# EAGLE design Power-Conversion (EAGLE 7.7.0)
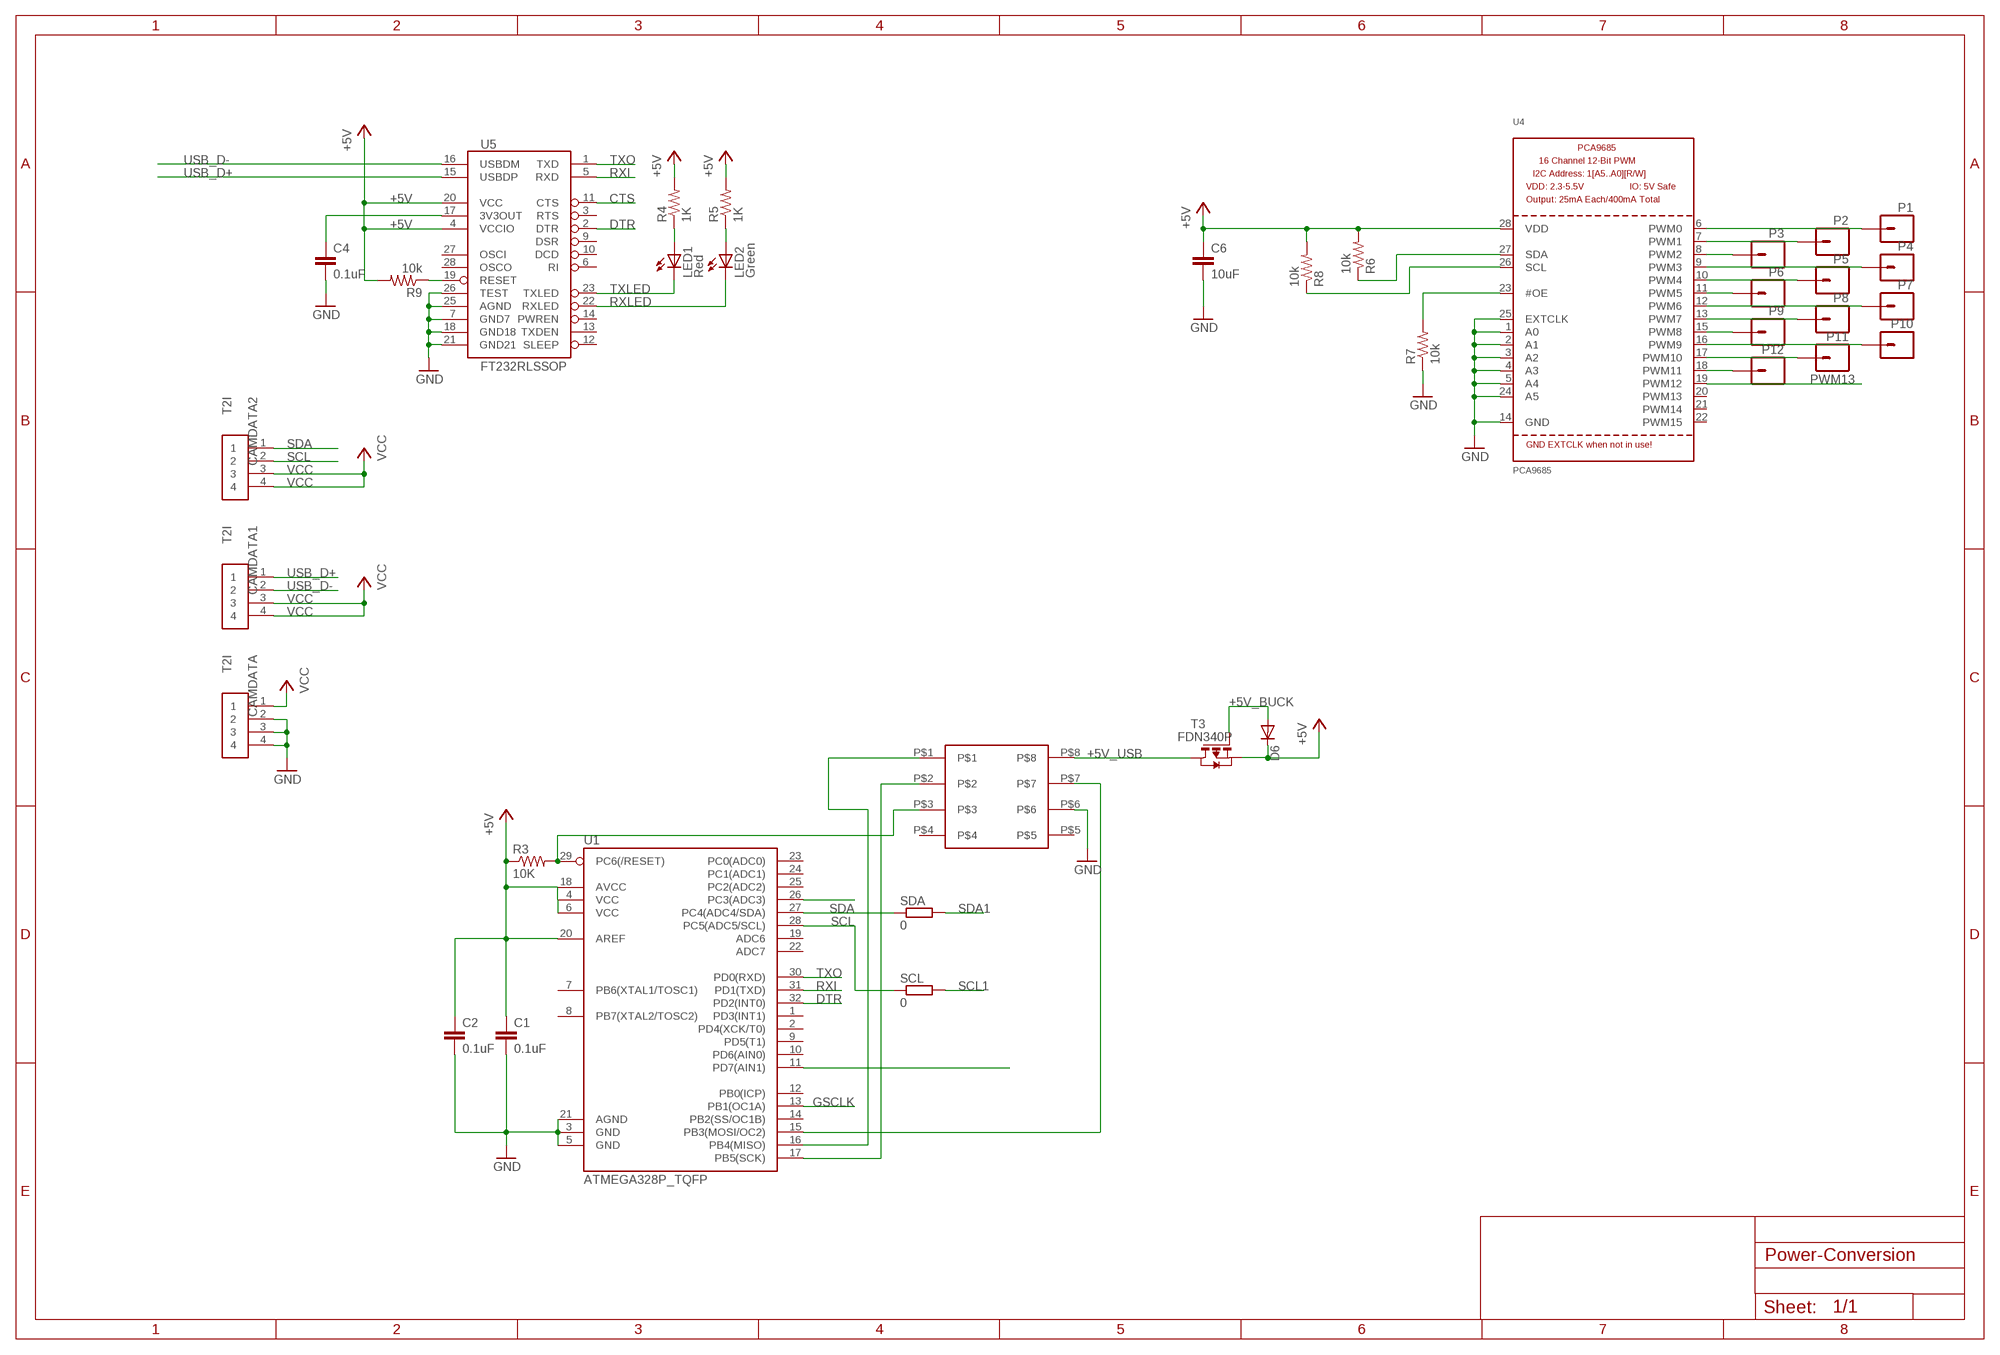
[diagram p0: schematic, sheet 1, part 1 of 2]
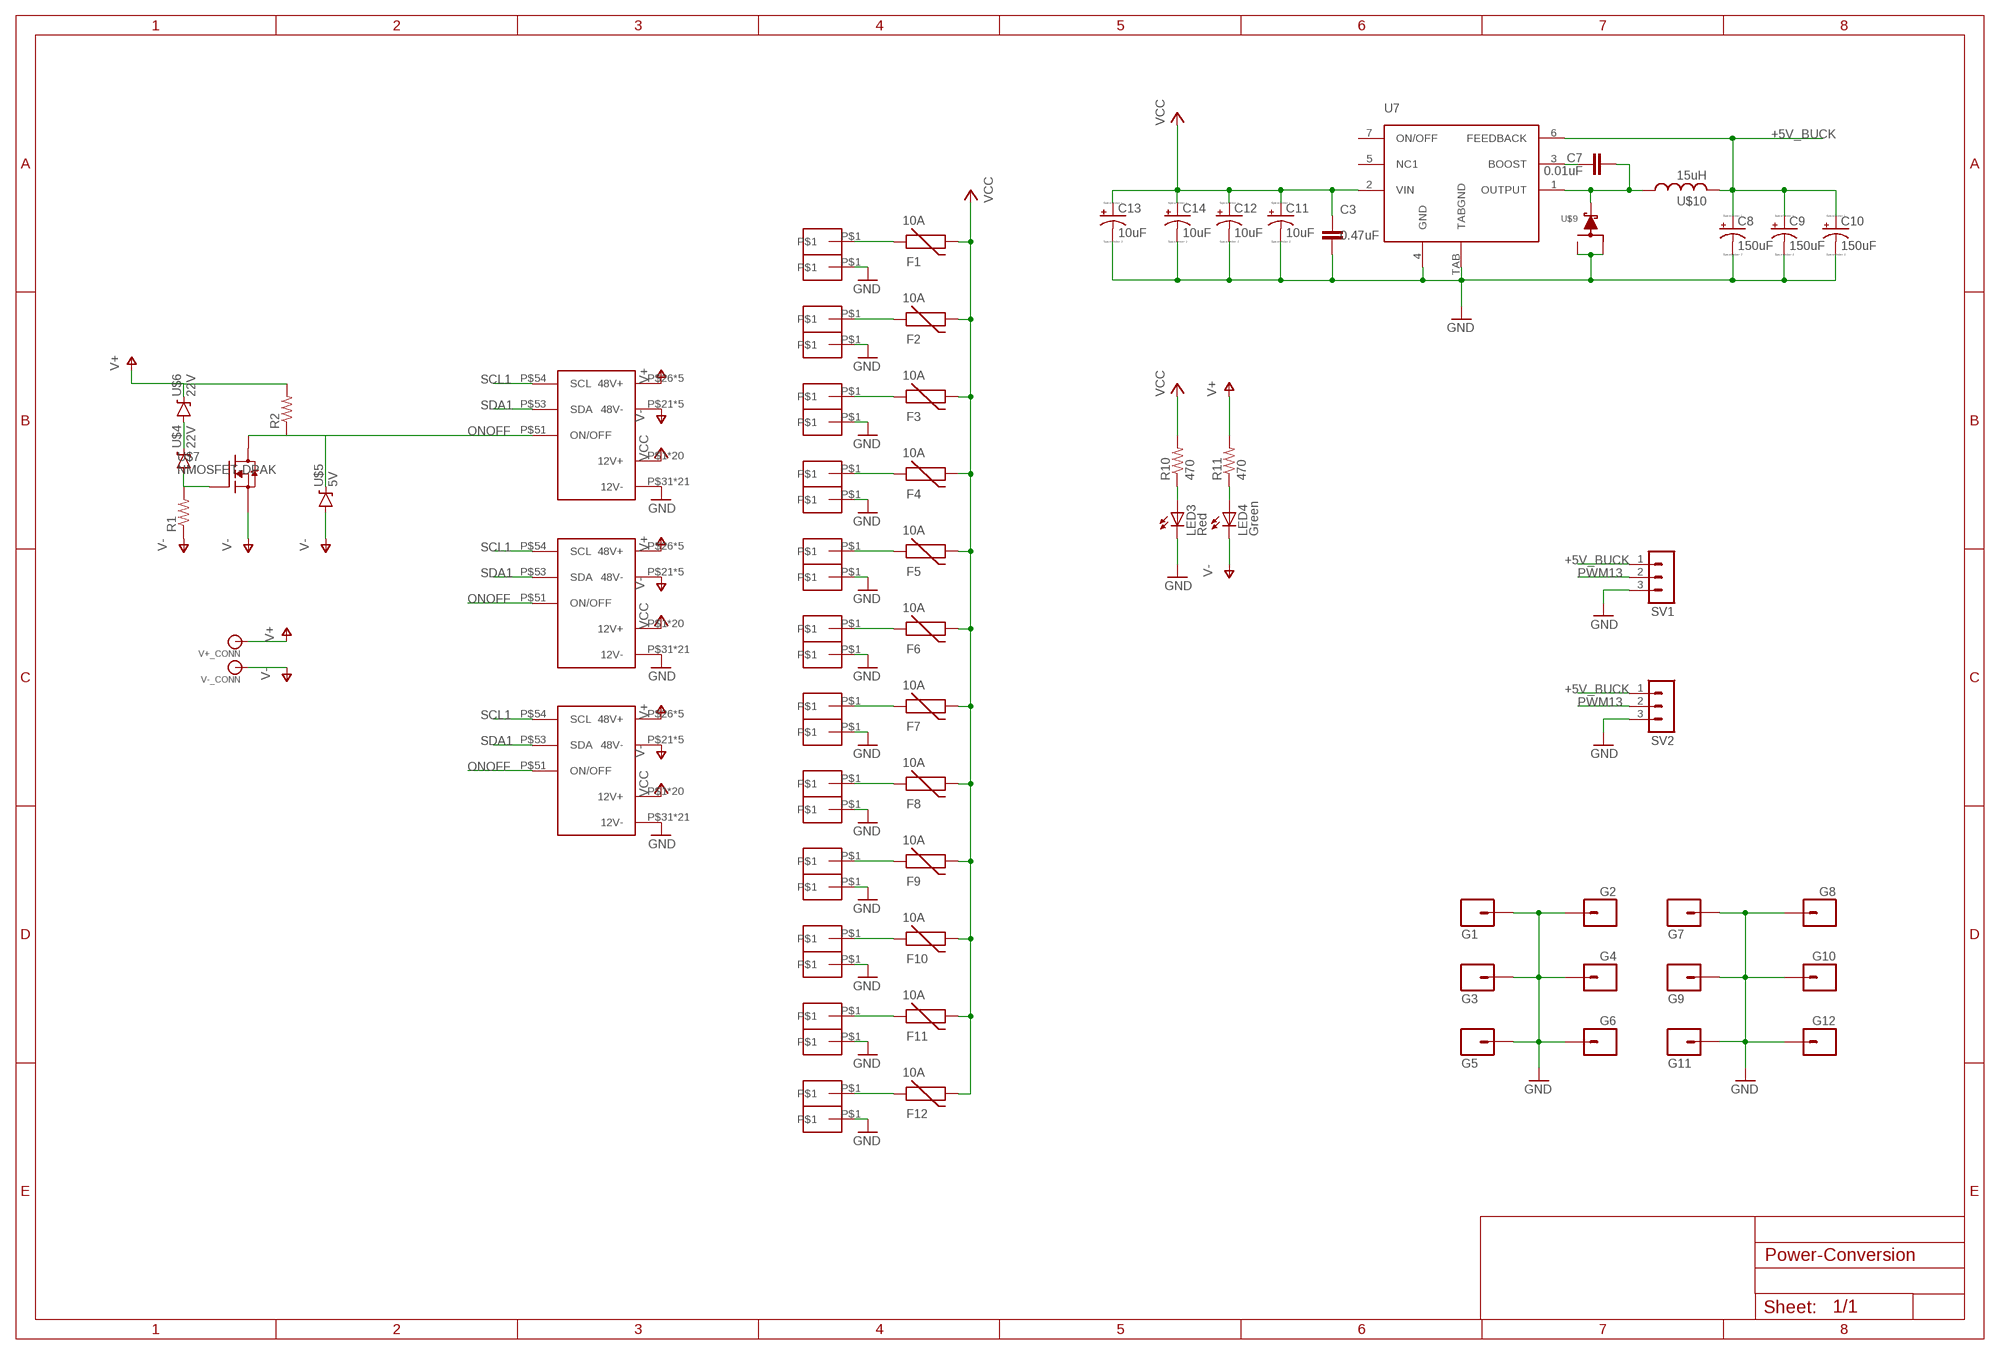
[diagram p1: schematic, sheet 1, part 2 of 2]

## Parts
C1  0.1uF  0.1UF-25V(+80/-20%)(0603)  [0603-CAP]
C2  0.1uF  0.1UF-25V(+80/-20%)(0603)  [0603-CAP]
C3  0.47uF  C-EUC0603  [C0603]
C4  0.1uF  0.1UF-25V(+80/-20%)(0603)  [0603-CAP]
C6  10uF  0.1UF-25V(+80/-20%)(0603)  [0603-CAP]
C7  0.01uF  CAP0603-CAP  [0603-CAP]
C8  150uF  C-TANTALUM(10UF_150UF)  [CTAN(7.30_4.30MM)]
C9  150uF  C-TANTALUM(10UF_150UF)  [CTAN(7.30_4.30MM)]
C10  150uF  C-TANTALUM(10UF_150UF)  [CTAN(7.30_4.30MM)]
C11  10uF  C-TANTALUM(10UF_150UF)  [CTAN(7.30_4.30MM)]
C12  10uF  C-TANTALUM(10UF_150UF)  [CTAN(7.30_4.30MM)]
C13  10uF  C-TANTALUM(10UF_150UF)  [CTAN(7.30_4.30MM)]
C14  10uF  C-TANTALUM(10UF_150UF)  [CTAN(7.30_4.30MM)]
CAMDATA  T2I  [T2I]
CAMDATA1  T2I  [T2I]
CAMDATA2  T2I  [T2I]
D6  DIODE-DO-214AC  [DO-214AC]
F1  10A  PTC(2920L)  [PTC-2920]
F2  10A  PTC(2920L)  [PTC-2920]
F3  10A  PTC(2920L)  [PTC-2920]
F4  10A  PTC(2920L)  [PTC-2920]
F5  10A  PTC(2920L)  [PTC-2920]
F6  10A  PTC(2920L)  [PTC-2920]
F7  10A  PTC(2920L)  [PTC-2920]
F8  10A  PTC(2920L)  [PTC-2920]
F9  10A  PTC(2920L)  [PTC-2920]
F10  10A  PTC(2920L)  [PTC-2920]
F11  10A  PTC(2920L)  [PTC-2920]
F12  10A  PTC(2920L)  [PTC-2920]
G1  M01PTH  [1X01]
G2  M01PTH  [1X01]
G3  M01PTH  [1X01]
G4  M01PTH  [1X01]
G5  M01PTH  [1X01]
G6  M01PTH  [1X01]
G7  M01PTH  [1X01]
G8  M01PTH  [1X01]
G9  M01PTH  [1X01]
G10  M01PTH  [1X01]
G11  M01PTH  [1X01]
G12  M01PTH  [1X01]
LED1  Red  LED0603  [LED-0603]
LED2  Green  LED0603  [LED-0603]
LED3  Red  LED0603  [LED-0603]
LED4  Green  LED0603  [LED-0603]
P1  M01PTH  [1X01]
P2  M01PTH  [1X01]
P3  M01PTH  [1X01]
P4  M01PTH  [1X01]
P5  M01PTH  [1X01]
P6  M01PTH  [1X01]
P7  M01PTH  [1X01]
P8  M01PTH  [1X01]
P9  M01PTH  [1X01]
P10  M01PTH  [1X01]
P11  M01PTH  [1X01]
P12  M01PTH  [1X01]
R1  RESISTOR0603-RES  [0603-RES]
R2  RESISTOR0603-RES  [0603-RES]
R3  10K  10KOHM-1/10W-1%(0603)0603  [0603-RES]
R4  1K  R-US_R0603  [R0603]
R5  1K  R-US_R0603  [R0603]
R6  10k  470OHM1/10W1%(0603)  [0603-RES]
R7  10k  470OHM1/10W1%(0603)  [0603-RES]
R8  10k  470OHM1/10W1%(0603)  [0603-RES]
R9  10k  RESISTOR0402-RES  [0402-RES]
R10  470  R-US_R0603  [R0603]
R11  470  R-US_R0603  [R0603]
SCL  0  R-EU_R0603  [R0603]
SDA  0  R-EU_R0603  [R0603]
SV1  MA03-1  [MA03-1]
SV2  MA03-1  [MA03-1]
T3  FDN340P  [SOT-23]
U1  ATMEGA328P_TQFP  [TQFP32-08]
U4  PCA9685  [TSSOP28]
U5  FT232RLSSOP  [SSOP28DB]
U7  LM2678  [LM2678]
U$1  POWER-BRICK-CONNECTOR  [POWER-BRICK-CONNECTOR]
U$2  POWER-BRICK-CONNECTOR  [POWER-BRICK-CONNECTOR]
U$3  POWER-BRICK-CONNECTOR  [POWER-BRICK-CONNECTOR]
U$4  22V  ZENER-SOT23  [SOT23-3]
U$5  5V  ZENER-SOT23  [SOT23-3]
U$6  22V  ZENER-SOT23  [SOT23-3]
U$7  NMOSFET-DPAK  [DPAK]
U$8  8_PIN_HEADER  [8_PIN_HEADER]
U$9  SWITCHMODE_SCHOTTKY  [DPAK-3]
U$10  15uH  HCMA1305  [HCMA1305]
V+_CONN  BANANA_CONN  [BANANA_CONN]
V+_ESC1  16_GUAGE_WIRE  [16_GUAGE_WIRE]
V+_ESC2  16_GUAGE_WIRE  [16_GUAGE_WIRE]
V+_ESC3  16_GUAGE_WIRE  [16_GUAGE_WIRE]
V+_ESC4  16_GUAGE_WIRE  [16_GUAGE_WIRE]
V+_ESC5  16_GUAGE_WIRE  [16_GUAGE_WIRE]
V+_ESC6  16_GUAGE_WIRE  [16_GUAGE_WIRE]
V+_ESC7  16_GUAGE_WIRE  [16_GUAGE_WIRE]
V+_ESC8  16_GUAGE_WIRE  [16_GUAGE_WIRE]
V+_ESC9  16_GUAGE_WIRE  [16_GUAGE_WIRE]
V+_ESC10  16_GUAGE_WIRE  [16_GUAGE_WIRE]
V+_ESC11  16_GUAGE_WIRE  [16_GUAGE_WIRE]
V+_ESC12  16_GUAGE_WIRE  [16_GUAGE_WIRE]
V-_CONN  BANANA_CONN  [BANANA_CONN]
V-_ESC1  16_GUAGE_WIRE  [16_GUAGE_WIRE]
V-_ESC2  16_GUAGE_WIRE  [16_GUAGE_WIRE]
V-_ESC3  16_GUAGE_WIRE  [16_GUAGE_WIRE]
V-_ESC4  16_GUAGE_WIRE  [16_GUAGE_WIRE]
V-_ESC5  16_GUAGE_WIRE  [16_GUAGE_WIRE]
V-_ESC6  16_GUAGE_WIRE  [16_GUAGE_WIRE]
V-_ESC7  16_GUAGE_WIRE  [16_GUAGE_WIRE]
V-_ESC8  16_GUAGE_WIRE  [16_GUAGE_WIRE]
V-_ESC9  16_GUAGE_WIRE  [16_GUAGE_WIRE]
V-_ESC10  16_GUAGE_WIRE  [16_GUAGE_WIRE]
V-_ESC11  16_GUAGE_WIRE  [16_GUAGE_WIRE]
V-_ESC12  16_GUAGE_WIRE  [16_GUAGE_WIRE]

## Nets
+5V: C1.1 C2.1 C6.1 D6.C R3.1 R4.2 R5.2 R6.2 R8.2 R9.2 T3.2(S) U1.4(VCC) U1.6(VCC) U1.18(AVCC) U1.20(AREF) U4.28(VDD) U5.4(VCCIO) U5.20(VCC)
+5V_BUCK: C8.+ C9.+ C10.+ D6.A SV1.1 SV2.1 T3.3(G) U7.6(FEEDBACK) U$10.P$2
+5V_USB: T3.1(D) U$8.P$8
CTS: U1.26(PC3(ADC3)) U5.11(CTS)
DTR: U1.32(PD2(INT0)) U5.2(DTR)
GND: C1.2 C2.2 C3.2 C4.2 C6.2 C8.- C9.- C10.- C11.- C12.- C13.- C14.- CAMDATA.2 CAMDATA.3 CAMDATA.4 G1.1 G2.1 G3.1 G4.1 G5.1 G6.1 G7.1 G8.1 G9.1 G10.1 G11.1 G12.1 LED3.C R7.1 SV1.3 SV2.3 U1.3(GND) U1.5(GND) U1.21(AGND) U4.1(A0) U4.2(A1) U4.3(A2) U4.4(A3) U4.5(A4) U4.14(GND) U4.24(A5) U4.25(EXTCLK) U5.7(GND7) U5.18(GND18) U5.21(GND21) U5.25(AGND) U5.26(TEST) U7.4(GND) U7.TAB(TABGND) U$1.P$31(12V-) U$1.P$32(12V-) U$1.P$33(12V-) U$1.P$34(12V-) U$1.P$35(12V-) U$1.P$36(12V-) U$1.P$37(12V-) U$1.P$38(12V-) U$1.P$39(12V-) U$1.P$40(12V-) U$1.P$41(12V-) U$1.P$42(12V-) U$1.P$43(12V-) U$1.P$44(12V-) U$1.P$45(12V-) U$1.P$46(12V-) U$1.P$47(12V-) U$1.P$48(12V-) U$1.P$49(12V-) U$1.P$50(12V-) U$1.P$52(12V-) U$2.P$31(12V-) U$2.P$32(12V-) U$2.P$33(12V-) U$2.P$34(12V-) U$2.P$35(12V-) U$2.P$36(12V-) U$2.P$37(12V-) U$2.P$38(12V-) U$2.P$39(12V-) U$2.P$40(12V-) U$2.P$41(12V-) U$2.P$42(12V-) U$2.P$43(12V-) U$2.P$44(12V-) U$2.P$45(12V-) U$2.P$46(12V-) U$2.P$47(12V-) U$2.P$48(12V-) U$2.P$49(12V-) U$2.P$50(12V-) U$2.P$52(12V-) U$3.P$31(12V-) U$3.P$32(12V-) U$3.P$33(12V-) U$3.P$34(12V-) U$3.P$35(12V-) U$3.P$36(12V-) U$3.P$37(12V-) U$3.P$38(12V-) U$3.P$39(12V-) U$3.P$40(12V-) U$3.P$41(12V-) U$3.P$42(12V-) U$3.P$43(12V-) U$3.P$44(12V-) U$3.P$45(12V-) U$3.P$46(12V-) U$3.P$47(12V-) U$3.P$48(12V-) U$3.P$49(12V-) U$3.P$50(12V-) U$3.P$52(12V-) U$8.P$6 U$9.P$1 U$9.P$3 V-_ESC1.P$1 V-_ESC2.P$1 V-_ESC3.P$1 V-_ESC4.P$1 V-_ESC5.P$1 V-_ESC6.P$1 V-_ESC7.P$1 V-_ESC8.P$1 V-_ESC9.P$1 V-_ESC10.P$1 V-_ESC11.P$1 V-_ESC12.P$1
GSCLK: U1.13(PB1(OC1A))
N$1: F1.1 V+_ESC1.P$1
N$2: P11.1 U4.17(PWM10)
N$3: F2.1 V+_ESC2.P$1
N$4: P12.1 U4.18(PWM11)
N$5: F3.1 V+_ESC3.P$1
N$6: F5.1 V+_ESC5.P$1
N$7: F6.1 V+_ESC6.P$1
N$8: F7.1 V+_ESC7.P$1
N$9: U$4.3(C) U$6.1(A)
N$10: R1.2 U$4.1(A) U$7.1(G)
N$11: F8.1 V+_ESC8.P$1
N$12: LED1.A R4.1
N$13: R3.2 U1.29(PC6(/RESET)) U$8.P$3
N$14: LED2.A R5.1
N$15: P1.1 U4.6(PWM0)
N$16: P2.1 U4.7(PWM1)
N$17: P3.1 U4.8(PWM2)
N$18: P4.1 U4.9(PWM3)
N$19: P5.1 U4.10(PWM4)
N$20: P6.1 U4.11(PWM5)
N$21: P7.1 U4.12(PWM6)
N$22: P8.1 U4.13(PWM7)
N$23: P9.1 U4.15(PWM8)
N$24: P10.1 U4.16(PWM9)
N$25: C7.1 U7.3(BOOST)
N$26: U1.15(PB3(MOSI/OC2)) U$8.P$7
N$27: U1.11(PD7(AIN1))
N$28: F9.1 V+_ESC9.P$1
N$29: U1.16(PB4(MISO)) U$8.P$1
N$30: F10.1 V+_ESC10.P$1
N$31: U1.17(PB5(SCK)) U$8.P$2
N$32: F4.1 V+_ESC4.P$1
N$33: F11.1 V+_ESC11.P$1
N$34: F12.1 V+_ESC12.P$1
N$35: R7.2 U4.23(#OE)
N$36: C7.2 U7.1(OUTPUT) U$9.P$4 U$10.P$1
N$37: C4.1 U5.17(3V3OUT)
N$38: R9.1 U5.19(RESET)
N$39: LED3.A R10.1
N$40: LED4.A R11.1
ONOFF: R2.1 U$1.P$51(ON/OFF) U$2.P$51(ON/OFF) U$3.P$51(ON/OFF) U$5.3(C) U$7.4(D1)
PWM13: SV1.2 SV2.2 U4.19(PWM12)
RXI: U1.31(PD1(TXD)) U5.5(RXD)
RXLED: LED2.C U5.22(RXLED)
SCL: CAMDATA2.2 R8.1 SCL.1 U1.28(PC5(ADC5/SCL)) U4.26(SCL)
SCL1: SCL.2 U$1.P$54(SCL) U$2.P$54(SCL) U$3.P$54(SCL)
SDA: CAMDATA2.1 R6.1 SDA.1 U1.27(PC4(ADC4/SDA)) U4.27(SDA)
SDA1: SDA.2 U$1.P$53(SDA) U$2.P$53(SDA) U$3.P$53(SDA)
TXLED: LED1.C U5.23(TXLED)
TXO: U1.30(PD0(RXD)) U5.1(TXD)
USB_D+: CAMDATA1.1 U5.15(USBDP)
USB_D-: CAMDATA1.2 U5.16(USBDM)
V+: R2.2 R11.2 U$1.P$26(48V+) U$1.P$27(48V+) U$1.P$28(48V+) U$1.P$29(48V+) U$1.P$30(48V+) U$2.P$26(48V+) U$2.P$27(48V+) U$2.P$28(48V+) U$2.P$29(48V+) U$2.P$30(48V+) U$3.P$26(48V+) U$3.P$27(48V+) U$3.P$28(48V+) U$3.P$29(48V+) U$3.P$30(48V+) U$6.3(C) V+_CONN.P$1
V-: LED4.C R1.1 U$1.P$21(48V-) U$1.P$22(48V-) U$1.P$23(48V-) U$1.P$24(48V-) U$1.P$25(48V-) U$2.P$21(48V-) U$2.P$22(48V-) U$2.P$23(48V-) U$2.P$24(48V-) U$2.P$25(48V-) U$3.P$21(48V-) U$3.P$22(48V-) U$3.P$23(48V-) U$3.P$24(48V-) U$3.P$25(48V-) U$5.1(A) U$7.3(S) V-_CONN.P$1
VCC: C3.1 C11.+ C12.+ C13.+ C14.+ CAMDATA1.3 CAMDATA1.4 CAMDATA2.3 CAMDATA2.4 CAMDATA.1 F1.2 F2.2 F3.2 F4.2 F5.2 F6.2 F7.2 F8.2 F9.2 F10.2 F11.2 F12.2 R10.2 U7.2(VIN) U$1.P$1(12V+) U$1.P$2(12V+) U$1.P$3(12V+) U$1.P$4(12V+) U$1.P$5(12V+) U$1.P$6(12V+) U$1.P$7(12V+) U$1.P$8(12V+) U$1.P$9(12V+) U$1.P$10(12V+) U$1.P$11(12V+) U$1.P$12(12V+) U$1.P$13(12V+) U$1.P$14(12V+) U$1.P$15(12V+) U$1.P$16(12V+) U$1.P$17(12V+) U$1.P$18(12V+) U$1.P$19(12V+) U$1.P$20(12V+) U$2.P$1(12V+) U$2.P$2(12V+) U$2.P$3(12V+) U$2.P$4(12V+) U$2.P$5(12V+) U$2.P$6(12V+) U$2.P$7(12V+) U$2.P$8(12V+) U$2.P$9(12V+) U$2.P$10(12V+) U$2.P$11(12V+) U$2.P$12(12V+) U$2.P$13(12V+) U$2.P$14(12V+) U$2.P$15(12V+) U$2.P$16(12V+) U$2.P$17(12V+) U$2.P$18(12V+) U$2.P$19(12V+) U$2.P$20(12V+) U$3.P$1(12V+) U$3.P$2(12V+) U$3.P$3(12V+) U$3.P$4(12V+) U$3.P$5(12V+) U$3.P$6(12V+) U$3.P$7(12V+) U$3.P$8(12V+) U$3.P$9(12V+) U$3.P$10(12V+) U$3.P$11(12V+) U$3.P$12(12V+) U$3.P$13(12V+) U$3.P$14(12V+) U$3.P$15(12V+) U$3.P$16(12V+) U$3.P$17(12V+) U$3.P$18(12V+) U$3.P$19(12V+) U$3.P$20(12V+)
Unconnected: U1.1(PD3(INT1)) U1.2(PD4(XCK/T0)) U1.7(PB6(XTAL1/TOSC1)) U1.8(PB7(XTAL2/TOSC2)) U1.9(PD5(T1)) U1.10(PD6(AIN0)) U1.12(PB0(ICP)) U1.14(PB2(SS/OC1B)) U1.19(ADC6) U1.22(ADC7) U1.23(PC0(ADC0)) U1.24(PC1(ADC1)) U1.25(PC2(ADC2)) U4.20(PWM13) U4.21(PWM14) U4.22(PWM15) U5.3(RTS) U5.6(RI) U5.9(DSR) U5.10(DCD) U5.12(SLEEP) U5.13(TXDEN) U5.14(PWREN) U5.27(OSCI) U5.28(OSCO) U7.5(NC1) U7.7(ON/OFF) U$8.P$4 U$8.P$5

## Library data of the parts
C1 C2 C4 = SparkFun-Capacitors:0.1UF-25V(+80/-20%)(0603): CAP-00810 Ceramic Standard decoupling cap; PROD_ID: CAP-00810
C3 = rcl:C-EU: CAPACITOR, European symbol
C6 = SparkFun-Capacitors:0.1UF-25V(+80/-20%)(0603): CAP-00810 Ceramic Standard decoupling cap; PROD_ID: CAP-00810; VALUE: 0.1uF
C7 = SparkFun-Passives:CAP: Capacitor Standard 0603 ceramic capacitor, and 0.1" leaded capacitor.
C8-C14 = PowerComponents:C-TANTALUM(10UF_150UF)
CAMDATA CAMDATA1 CAMDATA2 = BACKPLANE:T2I
D6 = DiscreteComponents:DIODE-: DIODE
F1-F12 = PowerComponents:PTC(2920L)
G1-G12 P1-P12 = SparkFun-Connectors:M01: Header 1 Standard 1-pin 0.1" header. Use with straight break away headers (SKU : PRT-00116), right angle break away headers (PRT-00553), swiss pins (PRT-00743), machine pins (PRT-00117), and female headers (PRT-00115). SMTSO-256-ET is a "flush mount" nut for a 4-40 screw. The older package used to be too tight, and did not allow it to sit properly thru the drill hit. The latest (0.165DIA) fits nice and snug.
LED1-LED4 = SparkFun:LED: LEDs Standard schematic elements and footprints for 5mm, 3mm, 1206, and 0603 sized LEDs. 5mm - Spark Fun Electronics SKU : COM-00529 (and others)
R1 R2 = SparkFun-Passives:RESISTOR: Resistor Basic schematic elements and footprints for 0603, 1206, and PTH resistors.
R3 = SparkFun-Resistors:10KOHM-1/10W-1%(0603): RES-00824; PROD_ID: RES-00824
R4 R5 R10 R11 = resistor:R-US_: RESISTOR, American symbol
R6-R8 = SparkFun-Resistors:470OHM1/10W1%(0603): RES-07869; PROD_ID: RES-07869; VALUE: 470
R9 = SparkFun:RESISTOR: Resistor Basic schematic elements and footprints for 0603, 1206, and PTH resistors.
SCL SDA = rcl:R-EU_: RESISTOR, European symbol
SV1 SV2 = con-lstb:MA03-1: PIN HEADER; OC_FARNELL: unknown; OC_NEWARK: unknown
T3 = DiscreteComponents:FDN340P: MOS FET; DIGIKEY: FDN340PCT-ND
U1 = SparkFun-DigitalIC:ATMEGA328P_TQFP; PROD_ID: IC-09069
U4 = microbuilder:PCA9685: PCA9685 - 16 Channel 12-Bit I2C PWM Controller 5.0V tolerant 16 channel, 12-bit I2C PWM controller with 25mA per output (max. 400mA total) Digikey: 568-5931-1-ND
U5 = SparkFun:FT232RL: USB UART FT232RL 4th Generation USB UART (USB <-> Serial) Controller. Spark Fun Electronics SKU : COM-00650
U7 = PowerComponents:LM2678: LM2678 Buck Converter IC 12V-to-5V
U$1-U$3 = MotherboardParts:POWER-BRICK-CONNECTOR
U$4 U$6 = MotherboardParts:ZENER-SOT23; PN-DIGI: BZX84C22LT1GOSCT-ND
U$5 = MotherboardParts:ZENER-SOT23
U$7 = MotherboardParts:NMOSFET-DPAK; PN-DIGI: 497-4329-1-ND; VDSS: 60V
U$8 = PowerComponents:8_PIN_HEADER
U$9 = PowerComponents:SWITCHMODE_SCHOTTKY: {Digi-Key Part Number: MBRD835LT4GOSCT-ND} {Voltage - DC Reverse (Vr) (Max): 35V} {Current - Average Rectified (Io): 8A} {Voltage - Forward (Vf) (Max) @ If: 510mV @ 8A} {Speed: Fast Recovery =< 500ns, > 200mA (Io)} {Current - Reverse Leakage @ Vr: 1.4mA @ 35V} {Mounting Type: Surface Mount} {Package / Case: TO-252-3, DPak (2 Leads + Tab), SC-63} {Supplier Device Package: DPAK-3} {Operating Temperature - Junction: -65°C ~ 150°C}
U$10 = DiscreteComponents:HCMA1305
V+_CONN V-_CONN = SparkFun-Connectors:BANANA_CONN: Through-hole banana jack
V+_ESC1-V+_ESC12 V-_ESC1-V-_ESC12 = PowerComponents:16_GUAGE_WIRE

## Net classes
1 power: width 0.254 mm

## Board
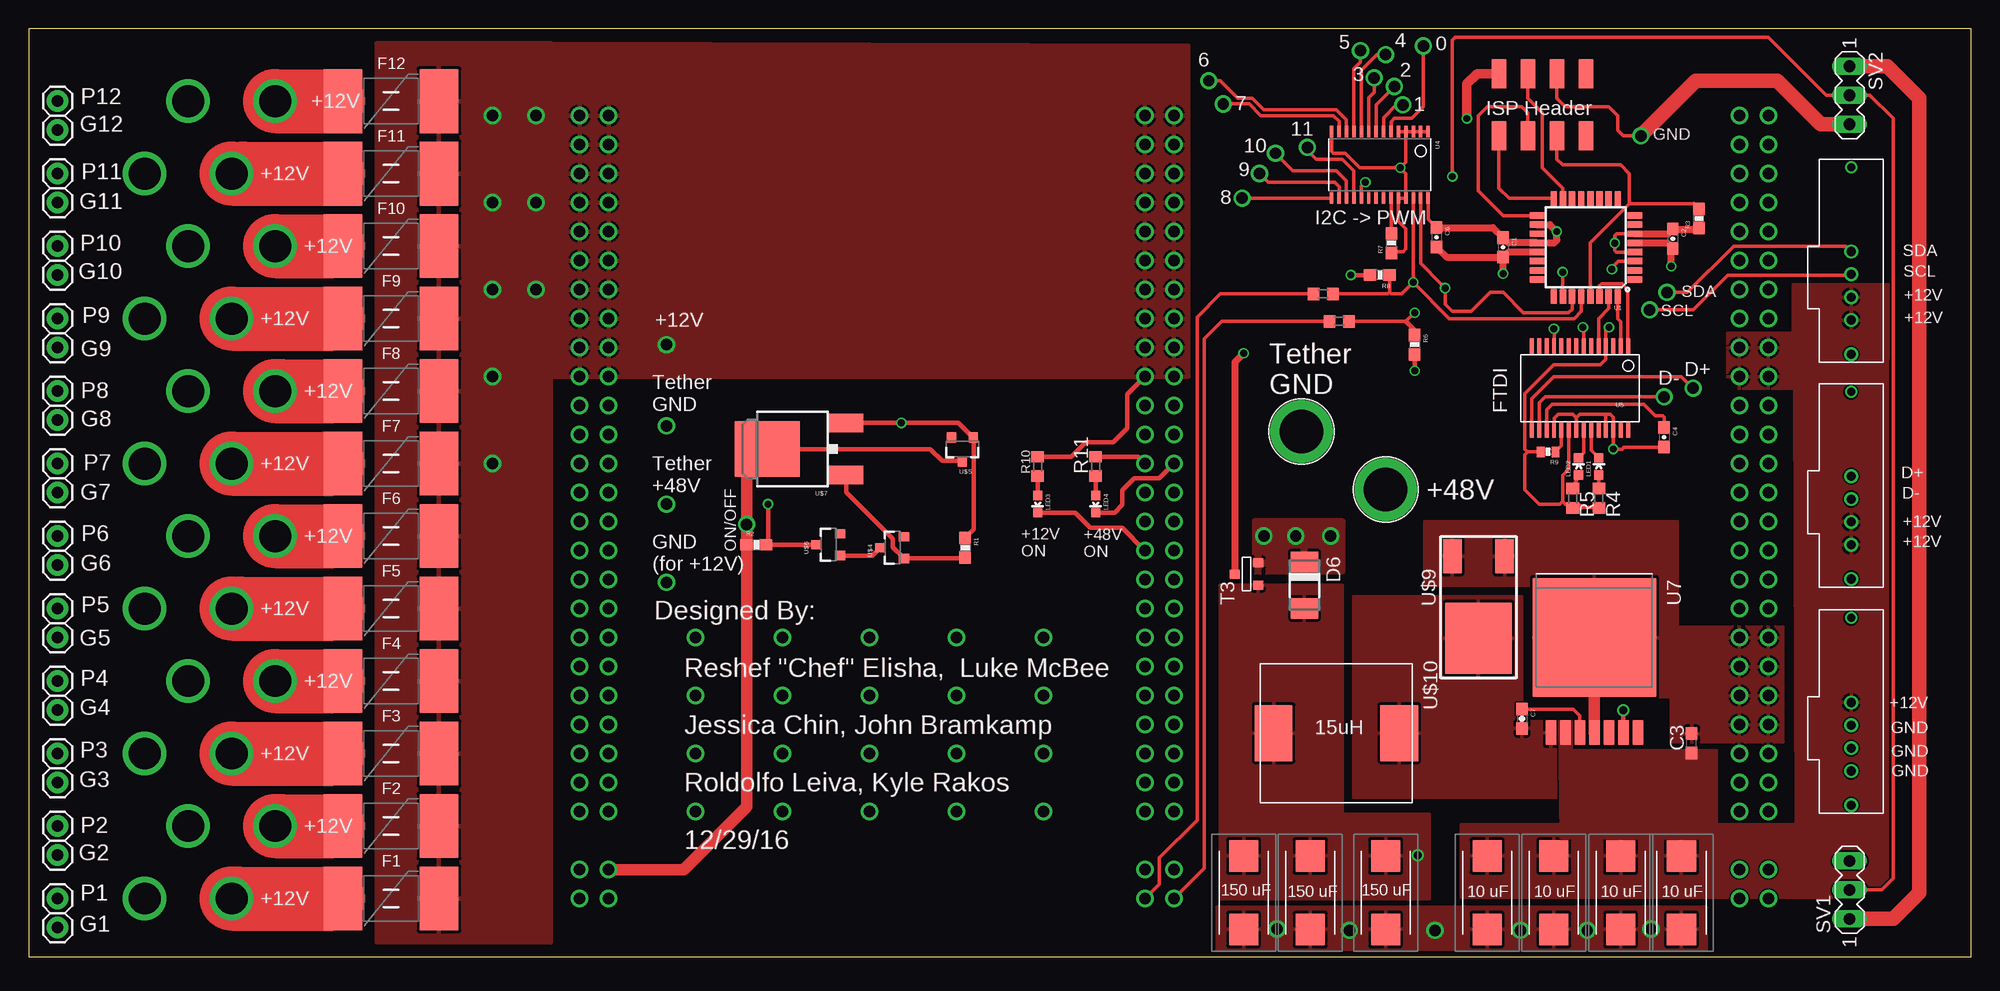
[diagram p2: board, top side]
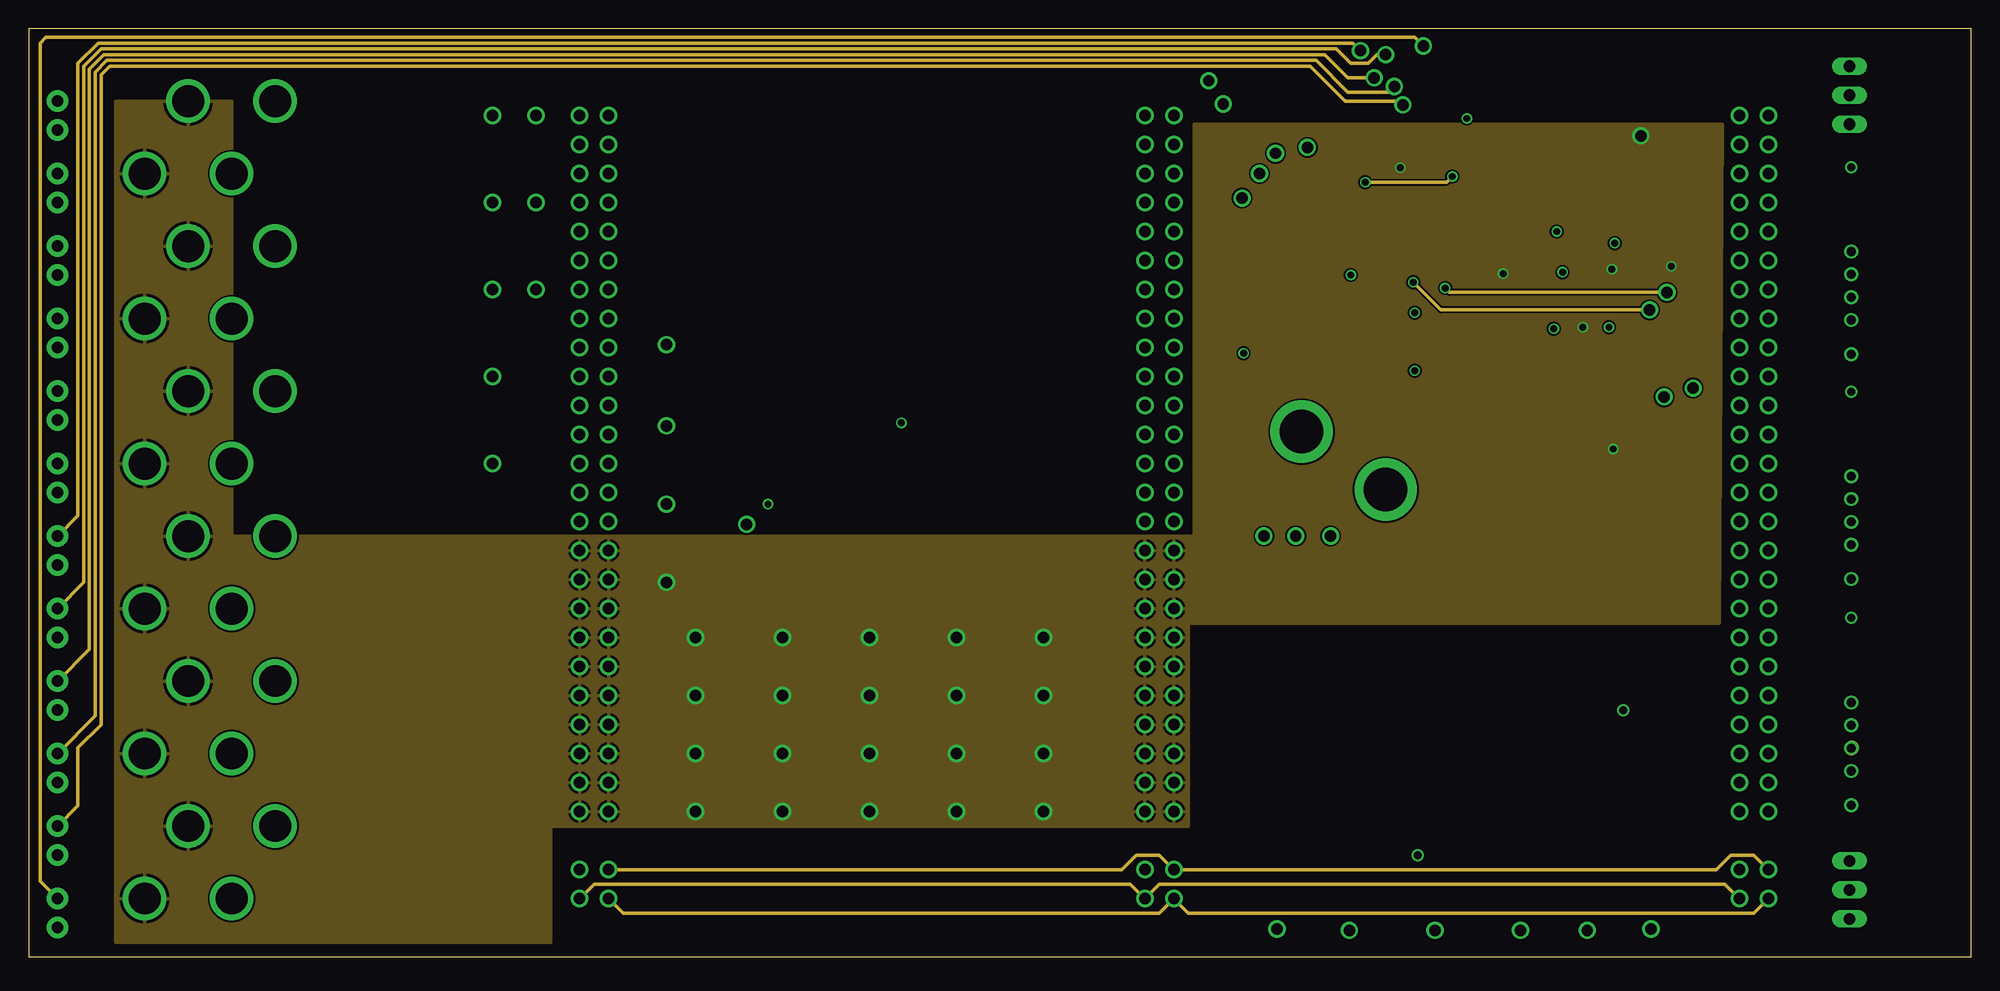
[diagram p3: board, inner layer Route2]
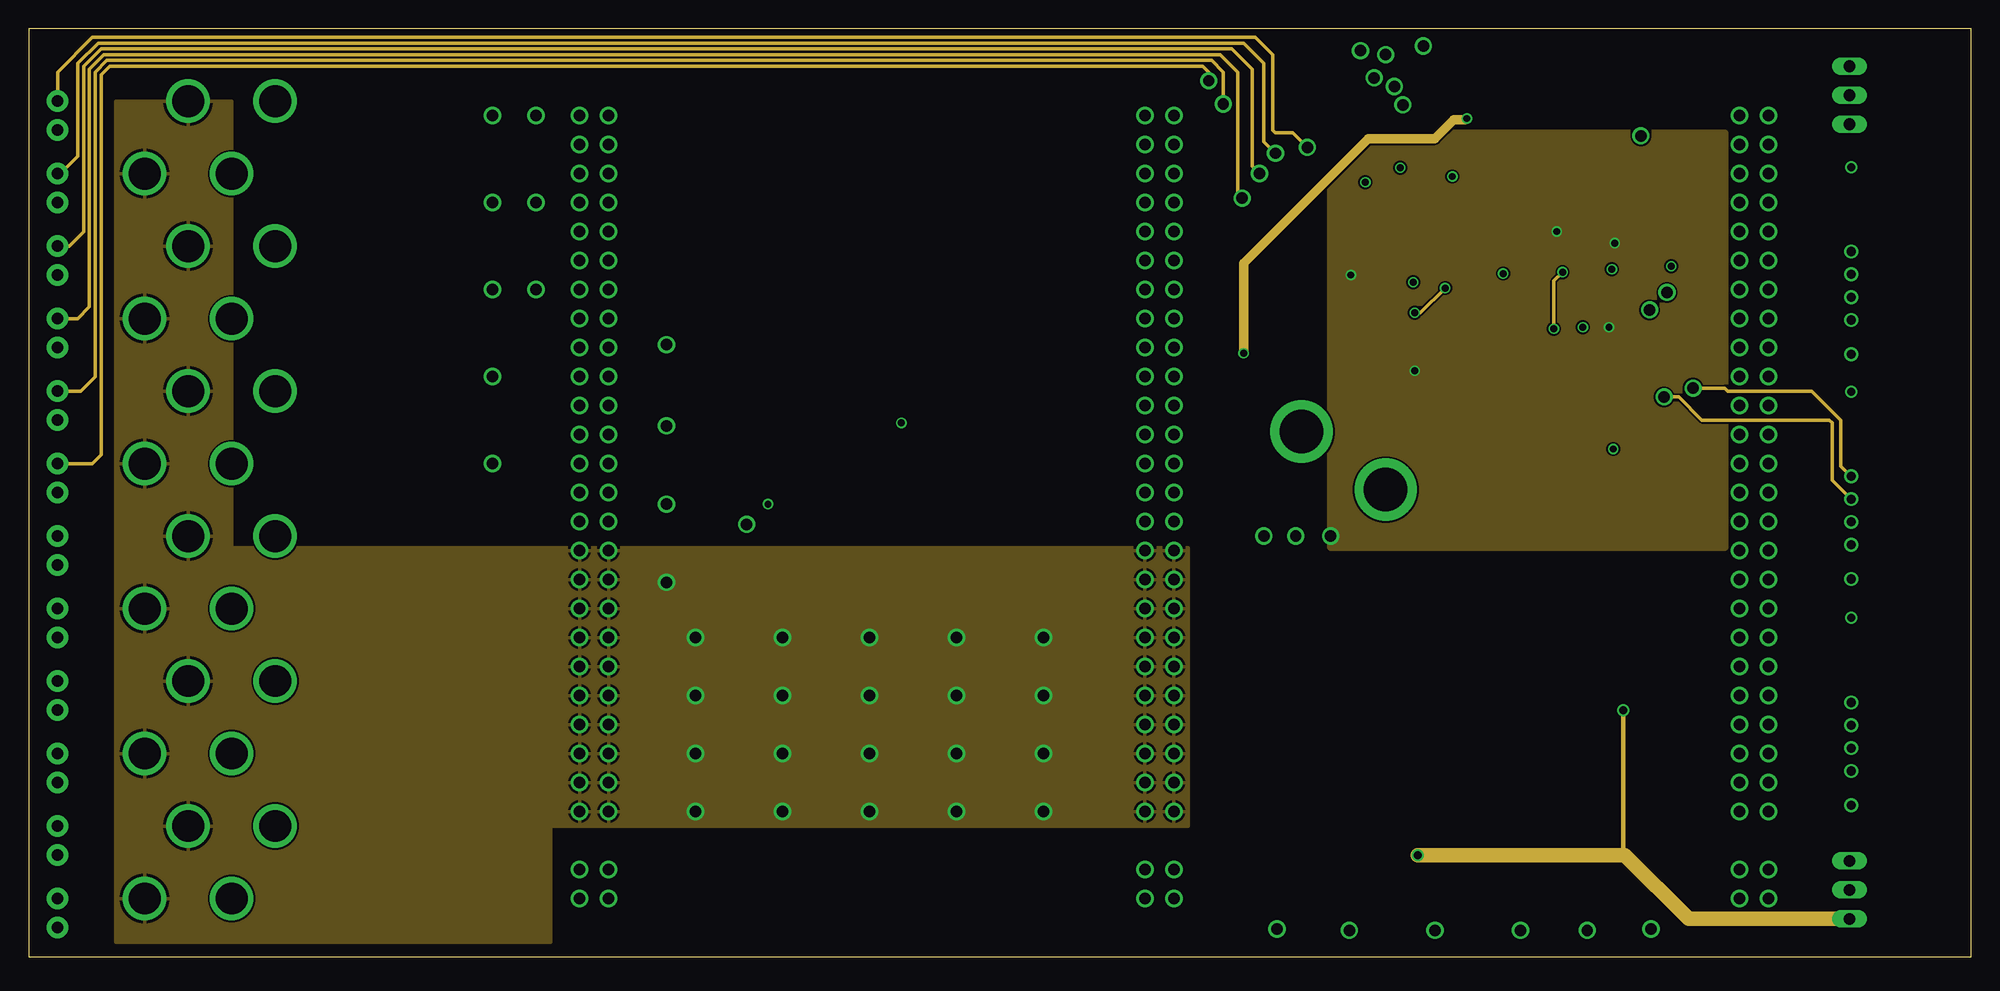
[diagram p4: board, inner layer Route15]
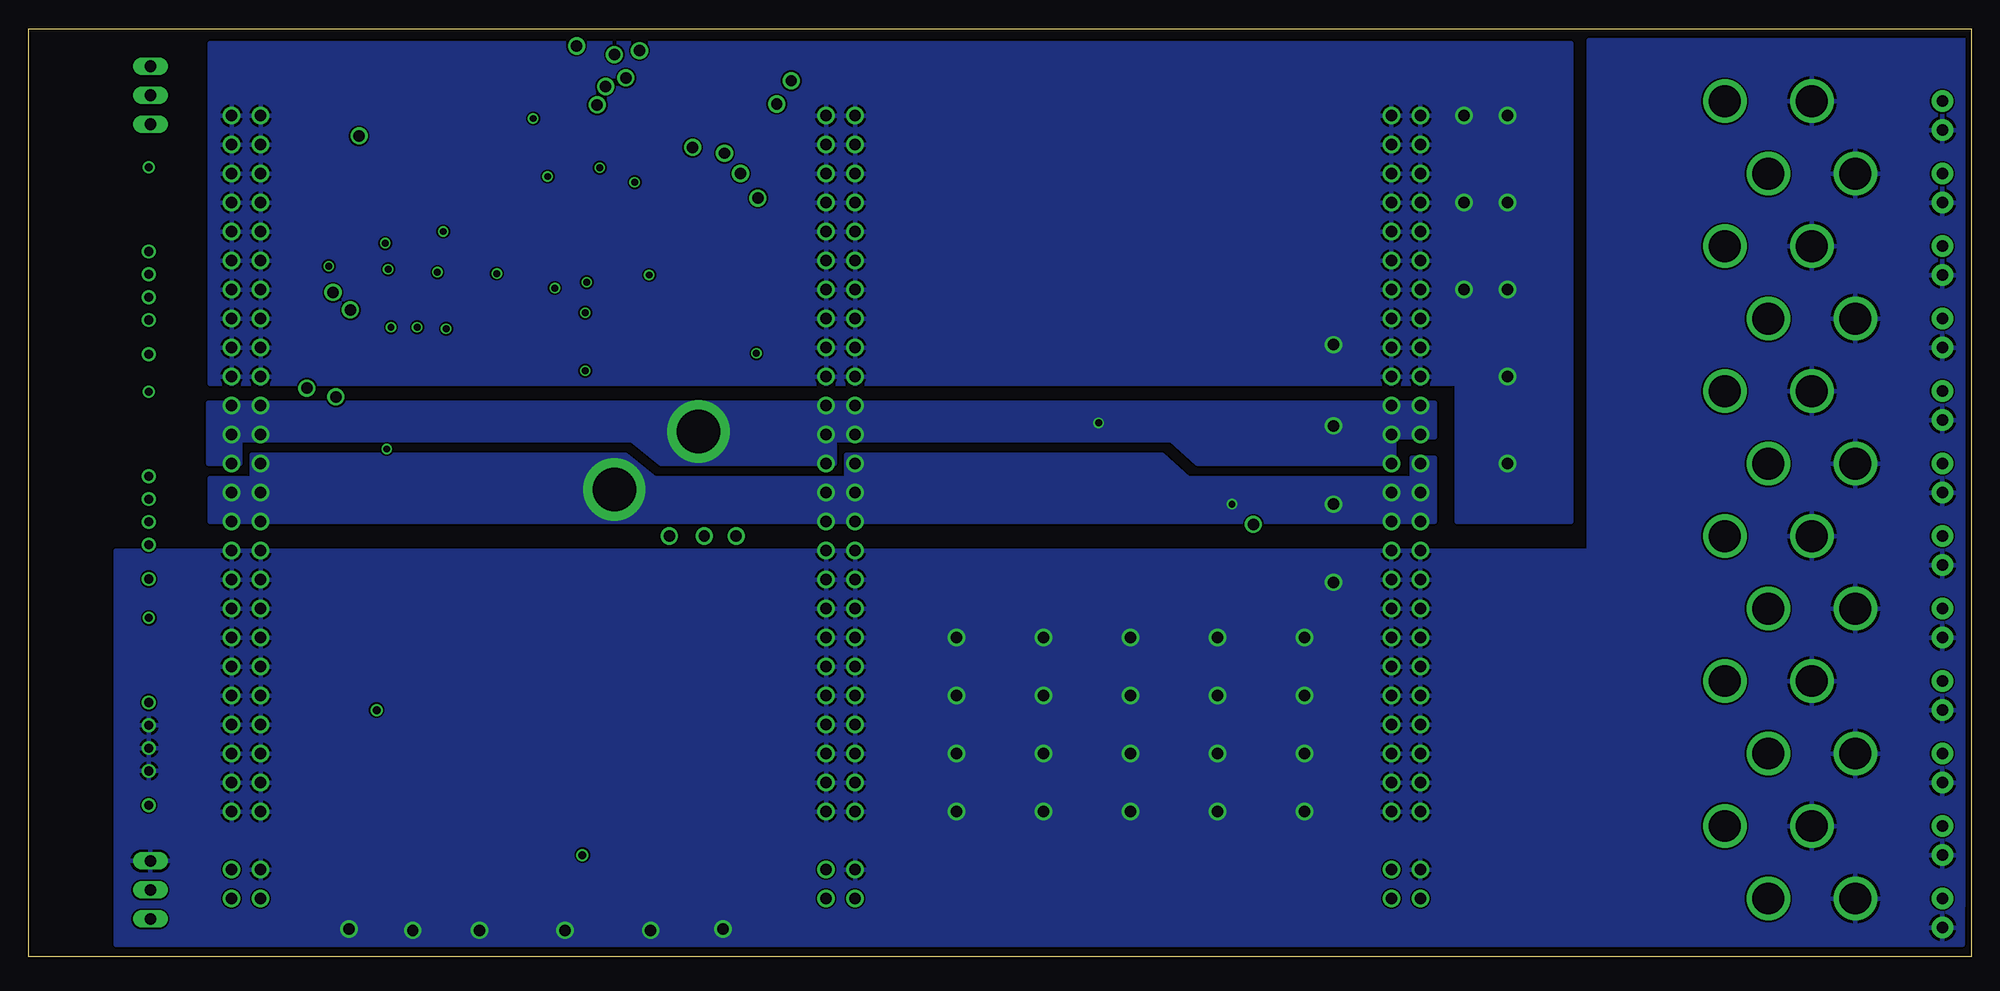
[diagram p5: board, bottom side, seen from below]

Size 170.18 x 81.28 mm. Coordinates in mm from the lower left corner, seen from the top.
Outline: 0,0 170.18,0 170.18,81.28 0,81.28 0,0
Copper layers (1*2*15*16): Top 0.035mm / dielectric 0.2mm / Route2 0.035mm / dielectric 1.2mm / Route15 0.035mm / dielectric 0.2mm / Bottom 0.035mm
Design rules "Elecrow_4-layer_PCB_eagle_rule": minimum track width 6mil, minimum drill 12mil, track to track 6mil, track to pad 6mil, pad to pad 6mil, via to via 8mil, smd to smd 0mil, copper to edge 20mil, drill to drill 10mil, minimum pad ring 6mil, minimum via ring 6mil, stop-mask expansion 0mil, vias tented up to drill 100mil, thermal gap 10mil

### Footprints (pad centres in the part's own frame; a part is rotated, then mirrored left to right if it is on the bottom)
0603-CAP = smd 1.1 x 1: 1 -0.85,0; 2 0.85,0
C0603 = smd 1.1 x 1: 1 -0.85,0; 2 0.85,0
CTAN(7.30_4.30MM) = smd 2.77 x 2.55: + -3.22,0; - 3.22,0
T2I = drill 0.8: 1 8.1,2.8; 2 10.1,2.8; 3 12.1,2.8; 4 14.1,2.8; S2 17.1,2.8 | drill 0.7: S1 0.7,2.8
DO-214AC = smd 1.8 x 2.4: A 2.025,0; C -2.025,0
PTC-2920 = smd 3.4 x 5.6: 1 -4.2,0; 2 4.2,0
1X01 = drill 1.016 pad 1.88: 1 0,0
LED-0603 = smd 0.8 x 0.8: A 0,-0.75; C 0,0.75
0603-RES = smd 1.1 x 1: 1 -0.85,0; 2 0.85,0
R0603 = smd 1 x 1.1: 1 -0.85,0; 2 0.85,0
0402-RES = smd 0.7 x 0.9: 1 -0.65,0; 2 0.65,0
MA03-1 = drill 1.016 long: 1 -2.54,0; 2 0,0; 3 2.54,0
SOT-23 = smd 0.787 x 0.889: 1 0.025,-1.016; 2 -0.94,1.016; 3 0.991,1.016
TQFP32-08 = smd 1.27 x 0.559: 1 -4.293,2.8; 2 -4.293,2; 3 -4.293,1.2; 4 -4.293,0.4; 5 -4.293,-0.4; 6 -4.293,-1.2; 7 -4.293,-2; 8 -4.293,-2.8; 17 4.293,-2.8; 18 4.293,-2; 19 4.293,-1.2; 20 4.293,-0.4; 21 4.293,0.4; 22 4.293,1.2; 23 4.293,2; 24 4.293,2.8 | smd 0.559 x 1.27: 9 -2.8,-4.293; 10 -2,-4.293; 11 -1.2,-4.293; 12 -0.4,-4.293; 13 0.4,-4.293; 14 1.2,-4.293; 15 2,-4.293; 16 2.8,-4.293; 25 2.8,4.293; 26 2,4.293; 27 1.2,4.293; 28 0.4,4.293; 29 -0.4,4.293; 30 -1.2,4.293; 31 -2,4.293; 32 -2.8,4.293
TSSOP28 = smd 0.305 x 0.991: 1 -4.225,-2.918; 2 -3.575,-2.918; 3 -2.925,-2.918; 4 -2.275,-2.918; 5 -1.625,-2.918; 6 -0.975,-2.918; 7 -0.325,-2.918; 8 0.325,-2.918; 9 0.975,-2.918; 10 1.625,-2.918; 11 2.275,-2.918; 12 2.925,-2.918; 13 3.575,-2.918; 14 4.225,-2.918; 15 4.225,2.918; 16 3.575,2.918; 17 2.925,2.918; 18 2.275,2.918; 19 1.625,2.918; 20 0.975,2.918; 21 0.325,2.918; 22 -0.325,2.918; 23 -0.975,2.918; 24 -1.625,2.918; 25 -2.275,2.918; 26 -2.925,2.918; 27 -3.575,2.918; 28 -4.225,2.918
SSOP28DB = smd 0.348 x 1.397: 1 -4.225,-3.656; 2 -3.575,-3.656; 3 -2.925,-3.656; 4 -2.275,-3.656; 5 -1.625,-3.656; 6 -0.975,-3.656; 7 -0.325,-3.656; 8 0.325,-3.656; 9 0.975,-3.656; 10 1.625,-3.656; 11 2.275,-3.656; 12 2.925,-3.656; 13 3.575,-3.656; 14 4.225,-3.656; 15 4.225,3.656; 16 3.575,3.656; 17 2.925,3.656; 18 2.275,3.656; 19 1.625,3.656; 20 0.975,3.656; 21 0.325,3.656; 22 -0.325,3.656; 23 -0.975,3.656; 24 -1.625,3.656; 25 -2.275,3.656; 26 -2.925,3.656; 27 -3.575,3.656; 28 -4.225,3.656
LM2678 = smd 2.159 x 0.914: 1 8.331,-3.81; 2 8.331,-2.54; 3 8.331,-1.27; 4 8.331,0; 5 8.331,1.27; 6 8.331,2.54; 7 8.331,3.81 | smd 10.414 x 10.795: TAB 0,0
POWER-BRICK-CONNECTOR = drill 1: P$1 -1.27,-34.29; P$2 1.27,-34.29; P$3 -1.27,-31.75; P$4 1.27,-31.75; P$5 -1.27,-29.21; P$6 1.27,-29.21; P$7 -1.27,-26.67; P$8 1.27,-26.67; P$9 -1.27,-24.13; P$10 1.27,-24.13; P$11 -1.27,-21.59; P$12 1.27,-21.59; P$13 -1.27,-19.05; P$14 1.27,-19.05; P$15 -1.27,-16.51; P$16 1.27,-16.51; P$17 -1.27,-13.97; P$18 1.27,-13.97; P$19 -1.27,-11.43; P$20 1.27,-11.43; P$21 -1.27,-8.89; P$22 1.27,-8.89; P$23 -1.27,-6.35; P$24 1.27,-6.35; P$25 -1.27,-3.81; P$26 1.27,-3.81; P$27 -1.27,-1.27; P$28 1.27,-1.27; P$29 -1.27,1.27; P$30 1.27,1.27; P$31 -1.27,3.81; P$32 1.27,3.81; P$33 -1.27,6.35; P$34 1.27,6.35; P$35 -1.27,8.89; P$36 1.27,8.89; P$37 -1.27,11.43; P$38 1.27,11.43; P$39 -1.27,13.97; P$40 1.27,13.97; P$41 -1.27,16.51; P$42 1.27,16.51; P$43 -1.27,19.05; P$44 1.27,19.05; P$45 -1.27,21.59; P$46 1.27,21.59; P$47 -1.27,24.13; P$48 1.27,24.13; P$49 -1.27,26.67; P$50 1.27,26.67; P$51 -1.27,31.75; P$52 1.27,31.75; P$53 -1.27,34.29; P$54 1.27,34.29
SOT23-3 = smd 0.8 x 0.9: 1 -0.95,-1; 2 0.95,-1; 3 0,1.1
DPAK = smd 1.6 x 3: 1 -2.28,-5.31; 3 2.28,-5.31 | smd 4.826 x 5.715: 4 0,1.588
8_PIN_HEADER = smd 1.27 x 2.54: P$1 0,0; P$2 2.54,0; P$3 5.08,0; P$4 7.62,0; P$5 7.62,5.46; P$6 5.08,5.46; P$7 2.54,5.46; P$8 0,5.46
DPAK-3 = smd 3 x 1.6: P$1 4.08,-2.285; P$3 4.08,2.285 | smd 6.2 x 5.8: P$4 -3.1,0
HCMA1305 = smd 4.9 x 3.3: P$1 0,5.5; P$2 0,-5.5
BANANA_CONN = drill 3.81 pad 5.461: P$1 0,0
16_GUAGE_WIRE = drill 2.8: P$1 0,0

### Placement (x,y rotation side)
C1  129.16,62.1 270 top
C2  144.02,62.87 270 top
C3  145.67,18.67 90 top
C4  143.26,45.47 270 top
C6  123.32,62.99 270 top
C7  130.81,20.83 270 top
C8  106.43,5.59 270 top
C9  112.27,5.59 270 top
C10  118.87,5.59 270 top
C11  127.76,5.59 270 top
C12  139.45,5.59 270 top
C13  133.6,5.59 270 top
C14  144.78,5.59 270 top
CAMDATA  156.84,30.35 270 top
CAMDATA1  156.84,50.16 270 top
CAMDATA2  156.84,69.85 270 top
D6  111.76,32.51 270 top
F1  31.75,5.08 0 top
F2  31.75,11.43 0 top
F3  31.75,17.78 0 top
F4  31.75,24.13 0 top
F5  31.75,30.48 0 top
F6  31.75,36.83 0 top
F7  31.75,43.18 0 top
F8  31.75,49.53 0 top
F9  31.75,55.88 0 top
F10  31.75,62.23 0 top
F11  31.75,68.58 0 top
F12  31.75,74.93 0 top
G1  2.54,2.54 0 top
G2  2.54,8.89 0 top
G3  2.54,15.24 0 top
G4  2.54,21.59 0 top
G5  2.54,27.94 0 top
G6  2.54,34.29 0 top
G7  2.54,40.64 0 top
G8  2.54,46.99 0 top
G9  2.54,53.34 0 top
G10  2.54,59.69 0 top
G11  2.54,66.04 0 top
G12  2.54,72.39 0 top
LED1  137.54,42.93 0 top
LED2  135.76,42.93 0 top
LED3  88.39,39.62 180 top
LED4  93.47,39.62 180 top
P1  2.54,5.08 0 top
P2  2.54,11.43 0 top
P3  2.54,17.78 0 top
P4  2.54,24.13 0 top
P5  2.54,30.48 0 top
P6  2.54,36.83 0 top
P7  2.54,43.18 0 top
P8  2.54,49.53 0 top
P9  2.54,55.88 0 top
P10  2.54,62.23 0 top
P11  2.54,68.58 0 top
P12  2.54,74.93 0 top
R1  82.04,35.81 270 top
R2  63.75,36.07 0 top
R3  146.3,64.64 90 top
R4  137.54,40.13 270 top
R5  135.25,40.13 270 top
R6  121.41,53.59 270 top
R7  119.38,62.48 90 top
R8  118.36,59.69 180 top
R9  133.1,44.2 180 top
R10  88.39,42.93 90 top
R11  93.47,42.93 90 top
SCL  113.41,58.04 180 top
SDA  114.81,55.63 180 top
SV1  159.51,5.84 90 top
SV2  159.51,75.44 270 top
T3  106.68,33.53 270 top
U1  136.4,62.1 180 top
U4  118.36,69.34 180 top
U5  135.89,49.78 180 top
U7  137.16,27.94 270 top
U$1  151.13,39.37 180 top
U$2  49.53,39.37 180 top
U$3  99.06,39.37 180 top
U$4  75.69,35.81 90 top
U$5  81.79,44.45 180 top
U$6  70.1,36.07 90 top
U$7  66.29,44.45 90 top
U$8  128.78,71.88 0 top
U$9  127,30.99 90 top
U$10  114.55,19.56 270 top
V+_CONN  118.87,40.89 180 top
V+_ESC1  17.78,5.08 0 top
V+_ESC2  21.59,11.43 0 top
V+_ESC3  17.78,17.78 0 top
V+_ESC4  21.59,24.13 0 top
V+_ESC5  17.78,30.48 0 top
V+_ESC6  21.59,36.83 0 top
V+_ESC7  17.78,43.18 0 top
V+_ESC8  21.59,49.53 0 top
V+_ESC9  17.78,55.88 0 top
V+_ESC10  21.59,62.23 0 top
V+_ESC11  17.78,68.58 0 top
V+_ESC12  21.59,74.93 0 top
V-_CONN  111.51,45.97 180 top
V-_ESC1  10.16,5.08 0 top
V-_ESC2  13.97,11.43 0 top
V-_ESC3  10.16,17.78 0 top
V-_ESC4  13.97,24.13 0 top
V-_ESC5  10.16,30.48 0 top
V-_ESC6  13.97,36.83 0 top
V-_ESC7  10.16,43.18 0 top
V-_ESC8  13.97,49.53 0 top
V-_ESC9  10.16,55.88 0 top
V-_ESC10  13.97,62.23 0 top
V-_ESC11  10.16,68.58 0 top
V-_ESC12  13.97,74.93 0 top

### Tracks (layer width: path | path; a pad name or v marks a point on that pad's centre or on a via)
+5V  (via drill 0.6, 1)
  Top 0.305: C6.1 122.59,64.57 U4.28 | R5.2 135.62,39.62 134.62,39.62 134.37,39.88 | 135.89,39.35 137.41,39.35 R4.2 | 138.18,53.43 U5.4 | U1.6 139.12,63.3 138.94,63.12 v138.94,62.48 138.94,61.85 139.08,61.7 U1.4 | U5.4 138.16,54.85 v138.43,55.12 | U5.4 138.16,52.31 137.67,51.82 133.6,51.82 131.06,49.28 131.06,44.45 131.32,44.2 | R9.2 131.32,44.2 | 131.32,44.2 131.06,43.94 131.06,40.89 132.33,39.62 134.11,39.62 134.37,39.88 | U5.20 134.91,42.71 134.37,42.16 134.37,39.88
  Top 0.406: R8.2 v115.82,59.69 | R6.2 v121.41,51.31
  Top 0.61: U1.6 143.61,63.3 C2.1 146.23,63.72 R3.1 | 135.89,39.35 R5.2 | U1.18 133.25,64.1 v133.86,63.5 133.86,62.74 133.62,62.5 U1.20 129.61,62.5 C1.1 128.27,63.84 C6.1
  other vias: 108.2,36.83 111,36.83 114.05,36.83
  pour Route15 (rank 2): 148.59,35.81 114.05,35.81 114.05,72.14 148.59,72.14
  pour Top: 107.44,33.78 115.06,33.78 115.06,38.1 107.44,38.1
+5V_BUCK  (via drill 0.7)
  Top 0.406: U7.6 v139.7,21.59
  Top 1.27: SV2.1 162.81,77.98 165.61,75.18 165.61,5.59 163.32,3.3 SV1.1
  Route15 0.406: v139.7,21.59 139.7,8.89
  Route15 1.27: SV1.1 145.41,3.3 139.83,8.89 139.7,8.89 v121.67,8.89
  pour Top (rank 5): 104.39,32.51 115.06,32.51 115.06,12.45 122.68,12.45 122.68,5.08 104.39,5.08
+5V_USB  (via drill 0.6)
  Top 0.61: v106.43,52.83 105.66,52.07 T3.1
  Top 0.813: U$8.P$8 126.87,77.34 125.98,76.45 v125.98,73.41
  Route15 0.813: v106.43,52.83 106.43,60.71 117.35,71.63 123.19,71.63 124.84,73.28 125.86,73.28 v125.98,73.41
CTS  (via drill 0.6)
  Top 0.305: U5.11 133.62,54.85 v133.6,54.99 | v134.37,59.94 134.37,57.84 U1.26
  Route15 0.305: v133.6,54.99 133.6,59.18 v134.37,59.94
DTR
  Top 0.305: U5.2 139.47,55.61 139.19,55.88 U1.32
GND  (via drill 0.6, 1)
  Top 0.305: U4.5 U4.4 | U4.4 U4.3 U4.2 U4.1 | U4.25 U4.24 119.99,64.42 120.65,63.75 120.65,61.98 120.4,61.72 119.47,61.72 R7.1 | U4.25 | U4.14 114.14,70.52 114.3,70.36 115.32,70.36 116.59,69.09 v120.14,69.09 | v120.14,69.09 120.65,68.58 120.65,66.44 U4.25 | U4.4 120.64,69.58 v120.14,69.09 | v138.68,60.2 138.68,60.33 139.26,60.9 U1.3 | U5.21 135.56,47.17 | 135.56,47.17 135.89,47.5 138.18,47.5 | 138.18,47.5 138.56,47.5 138.81,47.24 U5.26 v138.81,44.45 139.57,44.45 139.74,44.62 C4.2 | U5.25 138.16,47.49 138.18,47.5 | U5.7 136.22,55.05 v136.14,55.12 | U5.18 133.62,47.13 133.99,47.5 135.24,47.5 135.56,47.17 | U$8.P$6 133.86,75.18 134.62,74.42 138.43,74.42 139.19,73.66 139.19,72.39 139.7,71.88 v141.22,71.88
  Top 0.406: LED3.C 91.68,38.87 93.02,37.54 95.81,37.54 U$3.P$32
  Top 0.61: 143.98,61.98 C2.2 | U1.5 143.53,62.5 C2.2 | v143.89,60.45 143.89,61.89 C2.2 | U1.21 129.61,61.7 C1.2 | C6.2 124.21,61.25 C1.2 | v129.16,59.82 C1.2
  Top 1.016: U7.4 U7.TAB
  Top 1.27: SV2.3 156.97,72.9 153.16,76.71 146.05,76.71 v141.22,71.88
  Route2 1.27: 159.68,18.29 CAMDATA.3
  other vias: 58.42,12.7 58.42,17.78 58.42,22.86 58.42,27.94 66.04,27.94 66.04,22.86 66.04,17.78 66.04,12.7 73.66,27.94 81.28,27.94 88.9,27.94 73.66,22.86 81.28,22.86 88.9,22.86 73.66,17.78 81.28,17.78 88.9,17.78 73.66,12.7 81.28,12.7 88.9,12.7 109.35,2.41 115.7,2.29 123.19,2.29 130.68,2.29 136.53,2.29 142.11,2.41 55.88,32.77
  pour Bottom (rank 6): 33.53,80.26 0.25,80.26 0.76,1.02 33.53,1.02
  pour Bottom (rank 6): 33.27,1.02 162.56,1.02 162.56,35.56 33.02,35.56
  pour Route2 (rank 6): 101.6,11.43 101.6,36.83 17.78,36.83 17.78,74.93 7.62,74.93 7.62,1.27 45.72,1.27 45.72,11.43
  pour Route15 (rank 6): 101.6,11.43 45.72,11.43 45.72,1.27 7.62,1.27 7.62,74.93 17.78,74.93 17.78,35.81 101.6,35.81
  pour Route2 (rank 6): 96.52,36.83 102.11,36.83 102.11,72.9 148.34,72.9 148.08,29.21 96.27,29.21
  pour Top (rank 6): 104.14,0 146.94,0 146.94,4.32 104.14,4.32
  pour Top (rank 6): 122.3,38.1 144.4,38.1 144.4,28.83 153.67,28.83 153.67,18.8 143.89,18.8 143.89,22.73 131.83,22.73 131.83,32.51 122.3,32.51
N$1
  Top 0.305: F1.1 18.29,5.08
  Top 5.588: V+_ESC1.P$1 18.29,5.08 26.67,5.08
N$2  (via drill 1)
  Top 0.305: v109.22,70.36 110.74,68.83 114.55,68.83 115.44,67.95 U4.17
  Route15 0.305: P11.1 2.79,68.58 4.32,70.1 4.32,78.23 6.1,80.01 106.43,80.01 108.2,78.23 108.2,71.37 v109.22,70.36
N$3
  Top 0.305: F2.1 22.1,11.43
  Top 5.588: V+_ESC2.P$1 22.1,11.43 26.67,11.43
N$4  (via drill 1)
  Top 0.305: U4.18 116.08,66.44 116.08,68.83 115.06,69.85 112.78,69.85 112.01,70.61 v112.01,70.87
  Route15 0.305: P12.1 2.54,77.47 5.59,80.52 107.44,80.52 108.97,78.99 108.97,72.39 109.22,72.14 110.74,72.14 v112.01,70.87
N$5
  Top 0.305: F3.1 V+_ESC3.P$1
  Top 5.588: V+_ESC3.P$1 26.67,17.78
N$6
  Top 0.305: F5.1 18.54,30.48
  Top 5.588: V+_ESC5.P$1 18.54,30.48 26.67,30.48
N$7
  Top 0.305: F6.1 V+_ESC6.P$1
  Top 5.588: V+_ESC6.P$1 26.67,36.83
N$8
  Top 0.305: F7.1 V+_ESC7.P$1
  Top 5.588: V+_ESC7.P$1 26.67,43.18
N$9
  Top 0.406: U$6.1 73.9,35.12 U$4.3
N$10
  Top 0.305: 71.6,41.38 U$7.1
  Top 0.406: 71.6,41.38 71.6,40.66 75.69,36.58 75.69,35.86 U$4.1 81.94,34.86 R1.2
N$11
  Top 0.305: F8.1 22.1,49.53
  Top 5.588: V+_ESC8.P$1 22.1,49.53 26.67,49.53
N$12
  Top 0.305: LED1.A R4.1
N$13
  Top 0.305: U1.29 136.8,62.5 140.21,65.91 | 140.21,65.91 145.88,65.91 R3.2 | 140.21,65.91 140.21,68.58 139.45,69.34 134.37,69.34 133.86,69.85 U$8.P$3
N$14
  Top 0.305: LED2.A R5.1
N$15  (via drill 1)
  Top 0.305: v122.17,79.76 122.17,74.42 121.16,73.41 119.63,73.41 119.34,73.11 U4.6
  Route2 0.305: P1.1 1.02,6.6 1.02,80.01 1.52,80.52 121.41,80.52 v122.17,79.76
N$16  (via drill 1)
  Top 0.305: U4.7 118.69,73.48 119.81,74.6 v120.37,74.6
  Route2 0.305: P2.1 4.32,13.21 4.32,18.29 6.35,20.32 6.35,77.22 7.11,77.98 112.27,77.98 115.32,74.93 119.89,74.93 v120.37,74.6
N$17  (via drill 1)
  Top 0.305: v119.63,76.2 118.04,74.61 U4.8
  Route2 0.305: P3.1 5.84,21.08 5.84,77.47 6.86,78.49 112.78,78.49 115.57,75.69 119.13,75.69 v119.63,76.2
N$18  (via drill 1)
  Top 0.305: v117.86,76.96 117.86,75.69 117.39,75.22 U4.9
  Route2 0.305: P4.1 5.33,26.92 5.33,77.72 6.6,78.99 113.54,78.99 113.54,78.97 115.55,76.96 v117.86,76.96
N$19  (via drill 1)
  Top 0.305: U4.10 116.74,77.62 118.11,78.99 v118.87,78.99
  Route2 0.305: P5.1 4.83,32.77 4.83,77.98 6.35,79.5 114.55,79.5 115.82,78.23 117.35,78.23 118.11,78.99 v118.87,78.99
N$20  (via drill 1)
  Top 0.305: v116.66,79.35 116.66,78.33 116.08,77.75 116.08,72.27 U4.11
  Route2 0.305: P6.1 4.32,38.61 4.32,78.23 6.1,80.01 116,80.01 v116.66,79.35
N$21  (via drill 1)
  Top 0.305: v103.38,76.71 104.39,76.71 105.92,75.18 107.19,75.18 108.2,74.17 114.55,74.17 115.44,73.28 U4.12
  Route15 0.305: P7.1 5.59,43.18 6.35,43.94 6.35,77.22 7.11,77.98 102.87,77.98 103.38,77.47 v103.38,76.71
N$22  (via drill 1)
  Top 0.305: v104.65,74.68 106.93,74.68 107.95,73.66 114.3,73.66 114.81,73.15 114.81,72.28 U4.13
  Route15 0.305: P8.1 4.57,49.53 5.84,50.8 5.84,77.47 6.86,78.49 103.63,78.49 104.65,77.47 v104.65,74.68
N$23  (via drill 1)
  Top 0.305: v106.3,66.42 U4.15
  Route15 0.305: P9.1 4.32,55.88 5.33,56.9 5.33,77.72 6.6,78.99 104.39,78.99 105.92,77.47 105.92,66.8 v106.3,66.42
N$24  (via drill 1)
  Top 0.305: v107.82,68.58 108.58,67.82 114.43,67.82 114.81,67.44 114.81,66.44 U4.16
  Route15 0.305: P10.1 3.56,62.23 4.83,63.5 4.83,77.98 6.35,79.5 105.41,79.5 107.19,77.72 107.19,69.22 v107.82,68.58
N$25
  Top 0.305: U7.3 135.89,21.08 135.29,21.68 C7.1
N$26
  Top 0.305: U1.15 134.4,67.28 132.59,69.09 132.59,73.91 131.32,75.18 U$8.P$7
N$28
  Top 0.305: F9.1 V+_ESC9.P$1
  Top 5.588: V+_ESC9.P$1 26.67,55.88
N$29
  Top 0.305: U1.16 129.69,66.4 128.78,67.31 U$8.P$1
N$30
  Top 0.305: F10.1 V+_ESC10.P$1
  Top 5.588: V+_ESC10.P$1 26.67,62.23
N$31
  Top 0.305: U1.17 129.15,64.9 127,67.06 127,73.66 127.76,74.42 130.81,74.42 131.32,73.91 U$8.P$2
N$32
  Top 0.305: F4.1 V+_ESC4.P$1
  Top 5.588: V+_ESC4.P$1 26.67,24.13
N$33
  Top 0.305: F11.1 18.8,68.58
  Top 5.588: V+_ESC11.P$1 18.8,68.58 26.67,68.58
N$34
  Top 0.305: F12.1 V+_ESC12.P$1
  Top 5.588: V+_ESC12.P$1 26.67,74.93
N$35
  Top 0.305: U4.23 119.34,63.38 R7.2
N$36
  pour Top (rank 3): 116.08,31.5 130.81,31.5 130.81,21.59 130.81,13.97 116.08,13.97
  pour Top (rank 3): 129.29,20.57 133.86,20.57 133.86,13.97 129.29,13.97
N$37
  Top 0.305: U5.17 132.97,47.88 133.48,48.39 141.48,48.39 142.49,47.37 143.13,47.37 143.26,47.24 C4.1
N$38
  Top 0.305: U5.19 134.26,44.72 R9.1
N$39
  Top 0.406: R10.1 LED3.A
N$40
  Top 0.406: R11.1 LED4.A
ONOFF  (via drill 1)
  Top 0.406: U$7.4 78.99,44.45 80.01,43.43 81.7,43.43 U$5.3
  Top 0.61: 62.9,43.16 U$7.4
  Top 1.016: U$2.P$51 57.4,7.62 62.9,13.12 R2.1 v62.9,37.85 62.9,43.16
  Route2 0.305: U$2.P$51 95.76,7.62 97.03,8.89 99.06,8.89 U$3.P$51 147.83,7.62 149.1,8.89 151.13,8.89 U$1.P$51
PWM13  (via drill 0.6)
  Top 0.305: U4.19 116.74,67.46 v117.09,67.82 | v124.71,68.33 124.71,80.26 124.97,80.52 152.4,80.52 157.48,75.44 SV2.2 161.29,75.44 163.32,73.41 163.32,6.86 162.31,5.84 SV1.2
  Route2 0.305: v117.09,67.82 124.21,67.82 v124.71,68.33
RXI
  Top 0.305: U5.5 137.54,53.47 137.54,55.88 138.43,56.77 138.43,57.78 U1.31
RXLED
  Top 0.305: U5.22 136.22,44.13 LED2.C
SCL  (via drill 0.6, 1)
  Top 0.305: U1.28 136,56.5 135.38,55.88 124.46,55.88 v121.29,59.05 | U4.26 v121.29,59.05 | v121.29,59.05 120.28,58.04 119.38,58.04 119.21,58.2 | v141.99,56.64 145.8,56.64 148.84,59.69 159.59,59.69 CAMDATA2.2 | v121.29,59.05 v121.28,59.05 | R8.1 119.21,58.2 | SCL.1 119.05,58.04 119.21,58.2
  Route2 0.305: v141.99,56.64 123.7,56.64 v121.28,59.05
SCL1
  Top 0.305: SCL.2 104.39,58.04 102.36,56.01 102.36,11.94 99.06,8.64 99.06,6.35 U$3.P$54
  Route2 0.305: U$2.P$54 49.53,6.35 96.52,6.35 U$3.P$54 99.06,6.35 148.59,6.35 U$1.P$54
SDA  (via drill 0.6, 1)
  Top 0.305: U1.27 135.2,56.71 134.87,56.39 130.94,56.39 129.16,58.17 128.02,58.17 126.36,56.52 124.71,56.52 124.08,57.15 v124.08,58.55 123.7,58.93 123.7,58.95 121.94,60.71 U4.27 | SDA.1 120.65,55.63 v121.41,56.39 | v143.51,58.17 145.29,58.17 149.35,62.23 159.16,62.23 CAMDATA2.1
  Top 0.406: R6.1 121.41,54.86 120.65,55.63
  Route2 0.305: v143.51,58.17 124.46,58.17 v124.08,58.55
  Route15 0.305: v121.41,56.39 121.92,56.39 v124.08,58.55
SDA1
  Top 0.305: SDA.2 104.52,55.63 103,54.1 103,7.75 U$3.P$53
  Route2 0.305: U$2.P$53 52.07,3.81 99.06,3.81 U$3.P$53 101.6,3.81 151.13,3.81 U$1.P$53
TXLED
  Top 0.305: U5.23 136.87,44.35 LED1.C
TXO
  Top 0.305: U1.30 137.6,58.73 137.79,58.93 139.57,58.93 140.08,58.42 140.08,53.47 U5.1
USB_D+  (via drill 1)
  Top 0.305: U5.15 131.66,48.86 133.6,50.8 144.78,50.8 v145.8,49.78
  Route15 0.305: v145.8,49.78 148.59,49.78 148.84,49.53 156.21,49.53 158.75,46.99 158.75,42.96 CAMDATA1.1
USB_D-  (via drill 1)
  Top 0.305: U5.16 132.31,48.49 132.84,49.02 v143.26,49.02
  Route15 0.305: v143.26,49.02 144.53,49.02 146.56,46.99 157.73,46.99 157.99,46.74 157.99,41.72 CAMDATA1.2
V+  (via drill 0.6, 1)
  Top 0.406: U$6.3 R2.2 64.77,36.23 v64.77,39.62 | R11.2 97.19,43.78 U$3.P$26
  other vias: 55.88,39.62
  pour Bottom (rank 3, no thermals): 46.99,38.1 154.31,38.1 154.31,41.91 150.62,41.91 150.62,43.94 117.86,43.94 115.32,41.91 98.55,41.91 98.55,43.94 70.87,43.94 68.58,41.91 49.02,41.91 49.02,43.69 46.99,43.69
V-  (via drill 0.6, 1)
  Top 0.406: U$7.3 v76.45,46.73 v76.45,46.74 81.45,46.74 U$5.1 82.74,45.28 82.8,45.21 82.8,37.43 R1.1 | LED4.C 95.14,38.87 95.81,39.55 95.81,40.84 96.85,41.88 99.03,41.88 U$3.P$25
  other vias: 55.88,46.48
  pour Bottom (rank 4, no thermals): 46.99,48.51 154.43,48.51 154.43,43.18 151.64,43.18 151.64,45.21 117.35,45.21 114.81,43.18 99.57,43.18 99.57,45.21 70.1,45.21 67.82,43.18 50.55,43.18 50.55,45.47 46.99,45.47
VCC  (via drill 1)
  Top 0.406: R10.2 91.35,43.78 92.61,45.03 95,45.03 96.24,46.28 96.24,49.25 U$3.P$20
  other vias: 44.45,73.66 40.64,73.66 40.64,66.04 44.45,66.04 44.45,58.42 40.64,58.42 40.64,50.8 40.64,43.18 55.88,53.59
  pour Top: 32,80.01 101.6,79.76 101.6,50.8 33.27,50.8
  pour Top: 30.48,80.01 45.72,80.01 45.72,1.27 30.48,1.27
  pour Bottom (rank 2): 35.05,80.01 154.31,80.01 154.31,50.16 45.09,50.16 45.09,38.1 35.05,38.1
  pour Top (rank 2): 148.84,49.78 154.69,49.78 154.81,11.56 125.48,11.56 125.48,5.21 162.81,5.21 162.81,54.61 148.84,54.61
  pour Top: 154.56,50.04 154.56,58.83 162.89,58.83 162.81,50.04
  pour Top (no thermals): 134.11,20.57 135.13,20.57 135.13,18.03 147.83,18.03 147.83,10.41 134.24,10.41

### Text on the board
tPlace: 4 | 5 | 0 | 6 | 3 | 2 | +12V | 7 | 1 | ISP Header | 11 | GND | 10 | +12V | 9 | 8 | I2C -> PWM | +12V | SDA | SCL | SDA | +12V | SCL | +12V | +12V | +12V | D+ | D- | +12V | Tether / GND | Tether / GND | FTDI | +12V | D+ | Tether / +48V | +48V | D- | +12V | +12V | +12V | ON/OFF | +12V / ON | +48V / ON | GND / (for +12V) | +12V | +12V | +12V | GND | GND | +12V | GND | +12V | Designed By: / / Reshef "Chef" Elisha, Luke McBee / / Jessica Chin, John Bramkamp / / Roldolfo Leiva, Kyle Rakos / / 12/29/16 | 150 uF | 150 uF | 150 uF | 10 uF | 10 uF | 10 uF | 10 uF | +12V
200bmp: /home/lukemacaron/Downloads/zapados-baw.bmp